# EAGLE design Domino LED Overlap No Teardrop (EAGLE 6.5.0)
DATABASE: ./../Common/BOM/Domino_DB.txt; DRAWN: M.STEMPIN; REV: A
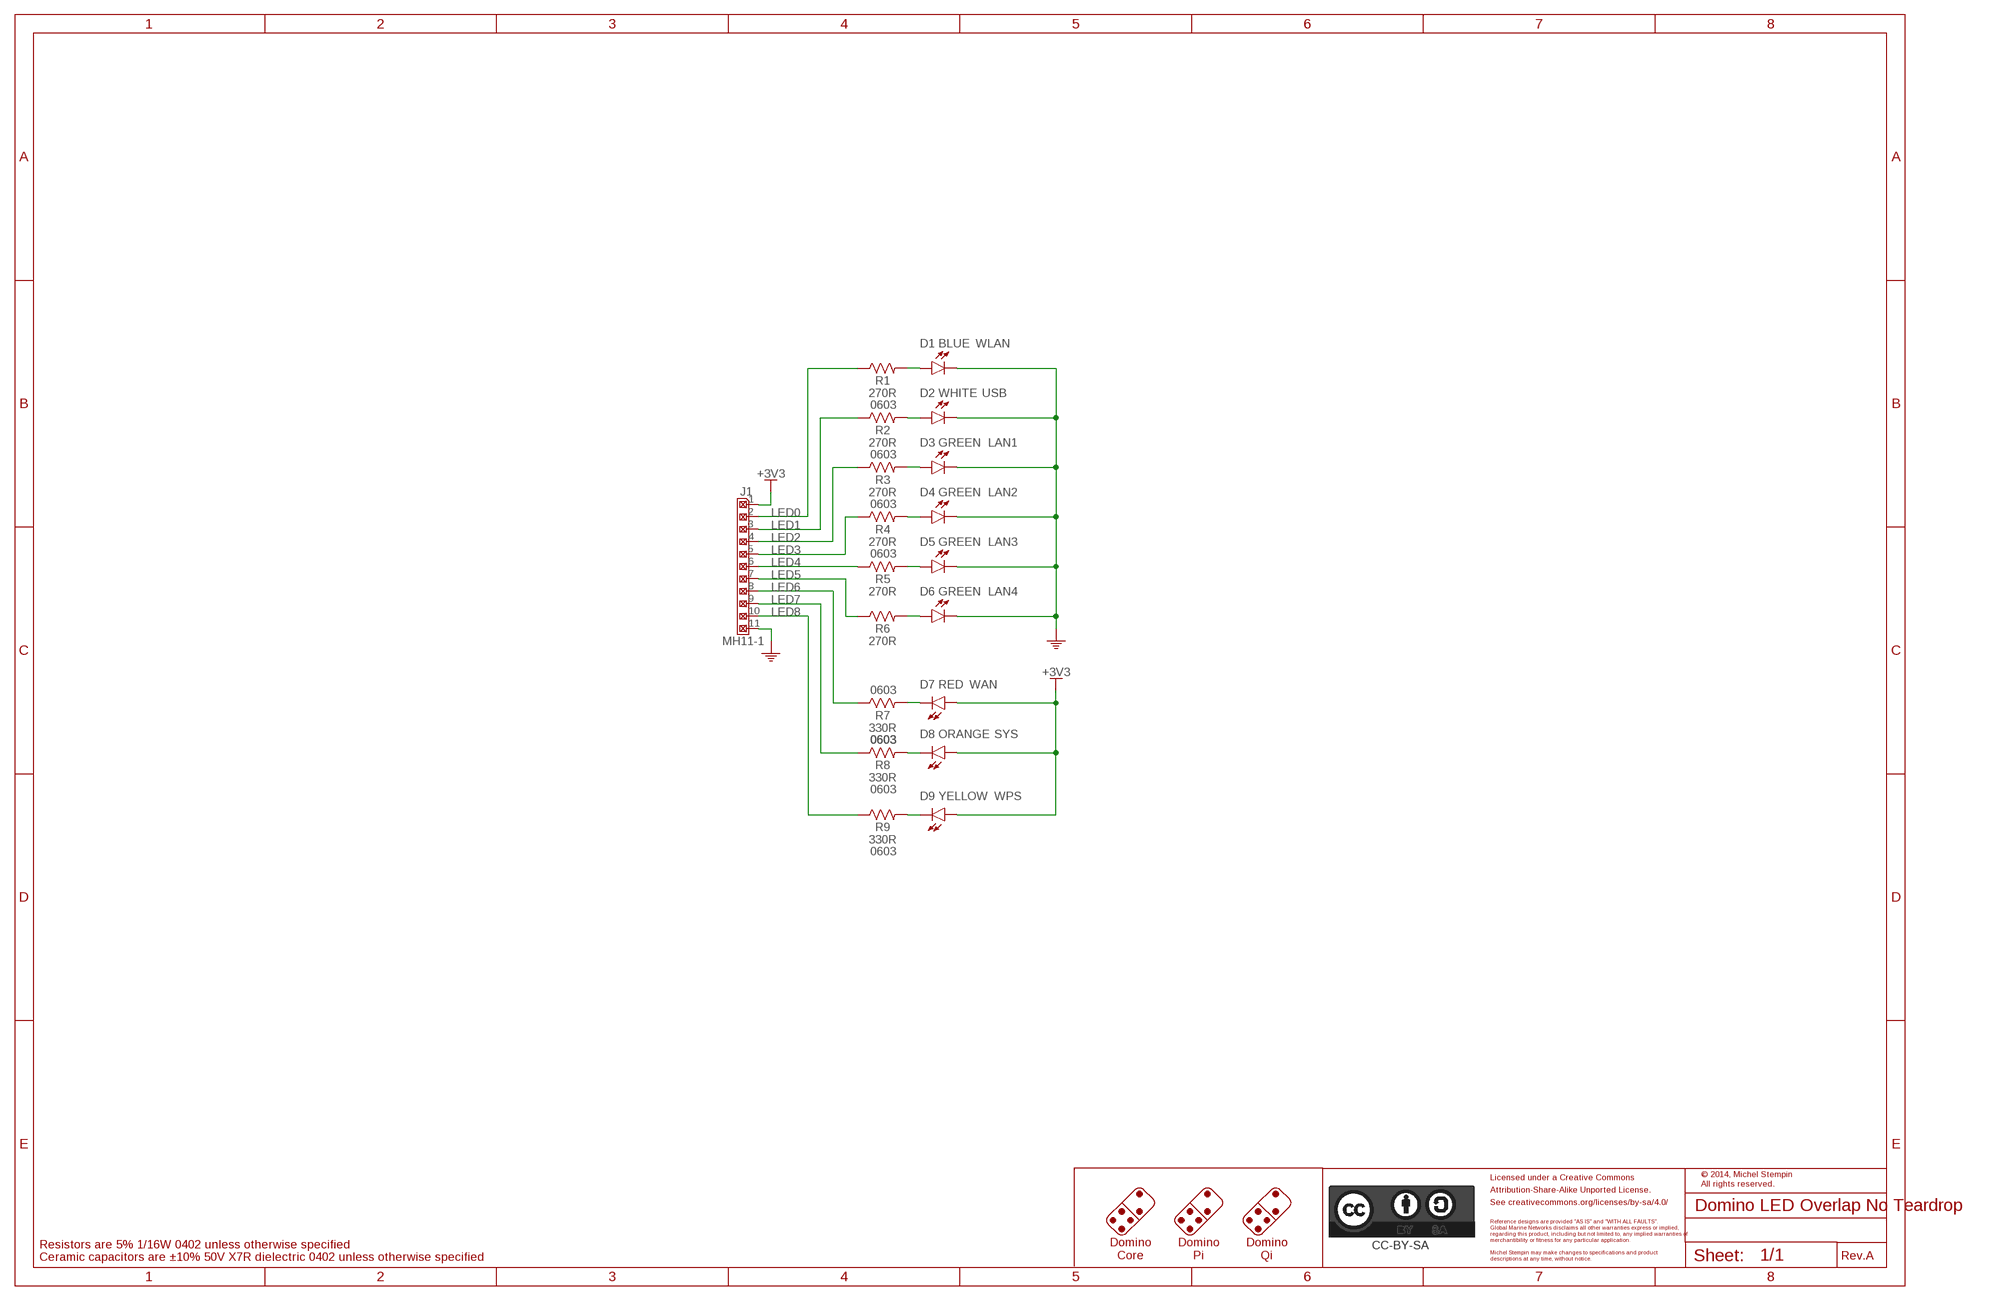
[diagram p0: schematic, sheet 1]

## Parts
CC-BY-SA1  CC-BY-SA_LOGO  [CC-BY-SA_LOGO]
D1  BLUE  LED_0603  [LED0603]
D2  WHITE  LED_0603  [LED0603]
D3  GREEN  LED_0603  [LED0603]
D4  GREEN  LED_0603  [LED0603]
D5  GREEN  LED_0603  [LED0603]
D6  GREEN  LED_0603  [LED0603]
D7  RED  LED_0603  [LED0603]
D8  ORANGE  LED_0603  [LED0603]
D9  YELLOW  LED_0603  [LED0603]
J1  MH11-1  [MH11-1-0.1]
R1  270R  RES_0603  [R0603]
R2  270R  RES_0603  [R0603]
R3  270R  RES_0603  [R0603]
R4  270R  RES_0603  [R0603]
R5  270R  RES_0603  [R0603]
R6  270R  RES_0603  [R0603]
R7  330R  RES_0603  [R0603]
R8  330R  RES_0603  [R0603]
R9  330R  RES_0603  [R0603]

## Nets
+3V3: D7.2(A) D8.2(A) D9.2(A) J1.1
GND: D1.1(C) D2.1(C) D3.1(C) D4.1(C) D5.1(C) D6.1(C) J1.11
LED0: J1.2 R1.1
LED1: J1.3 R2.1
LED2: J1.4 R3.1
LED3: J1.5 R4.1
LED4: J1.6 R5.1
LED5: J1.7 R6.1
LED6: J1.8 R7.1
LED7: J1.9 R8.1
LED8: J1.10 R9.1
N$2: D1.2(A) R1.2
N$3: D2.2(A) R2.2
N$4: D3.2(A) R3.2
N$5: D4.2(A) R4.2
N$6: D5.2(A) R5.2
N$7: D7.1(C) R7.2
N$8: D8.1(C) R8.2
N$9: D9.1(C) R9.2
N$10: D6.2(A) R6.2

## Notes on the sheet
- WLAN
- USB
- LAN1
- LAN2
- LAN3
- LAN4
- WAN
- SYS
- WPS
- Licensed under a Creative Commons
- © 2014, Michel Stempin
  All rights reserved.
- Attribution-Share-Alike Unported License.
- See creativecommons.org/licenses/by-sa/4.0/
- Reference designs are provided "AS IS" and "WITH ALL FAULTS".
- Global Marine Networks disclaims all other warranties express or implied,
- regarding this product, including but not limited to, any implied warranties of
- merchantibility or fitness for any particular application.
- Resistors are 5% 1/16W 0402 unless otherwise specified
- Domino
  Core
- Domino
  Pi
- Domino
  Qi
- Michel Stempin may make changes to specifications and product
- Ceramic capacitors are ±10% 50V X7R dielectric 0402 unless otherwise specified | descriptions at any time, without notice. | Rev.

## Library data of the parts
CC-BY-SA1 = Domino:CC-BY-SA_LOGO: Attribution-Share-Alike Unported License See creativecommons.org/licenses/by-sa/3.0/ for details.; BOM: EXCLUDE
D1 = Domino:LED_: LED; PARTNO: LED0603-BLUE
D2 = Domino:LED_: LED; PARTNO: LED0603-WHITE
D3-D6 = Domino:LED_: LED; PARTNO: LED0603-GREEN
D7 = Domino:LED_: LED; PARTNO: LED0603-RED
D8 = Domino:LED_: LED; PARTNO: LED0603-ORANGE
D9 = Domino:LED_: LED; PARTNO: LED0603-YELLOW
J1 = Domino:MH11-1: 11x1 Pin Male Header; PARTNO: MH11-1-0.1
R1-R6 = Domino:RES_: Resistor; PARTNO: R0603_270R_5%_125mW; RATE: 125mW; SIZE: 0603; TOL: 5%
R7-R9 = Domino:RES_: Resistor; PARTNO: R0603_330R_5%_125mW; RATE: 125mW; SIZE: 0603; TOL: 5%

## Net classes
1 USB: width 0.254 mm, clearance 0.127 mm
2 PoE: width 0.61 mm, clearance 0.13 mm to class 0, clearance 0.13 mm to class 1, clearance 0.13 mm

## Board
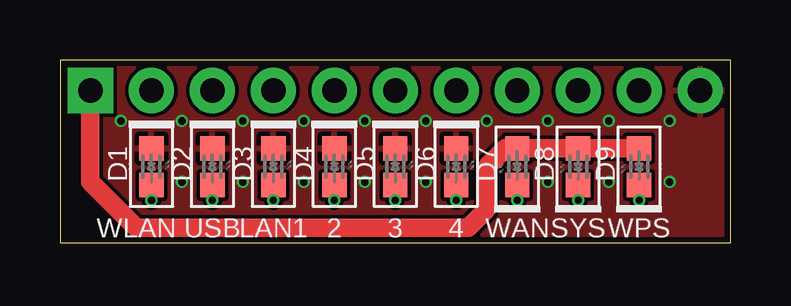
[diagram p1: board, top side]
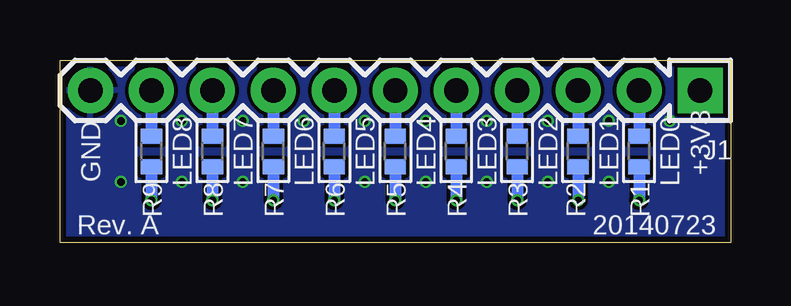
[diagram p2: board, bottom side, seen from below]

Size 27.94 x 7.62 mm. Coordinates in mm from the lower left corner, seen from the top.
Outline: 0,0 27.94,0 27.94,7.62 0,7.62 0,0
Copper layers (1*16): Top 0.043mm / dielectric 1mm / Bottom 0.043mm
Design rules "Domino": minimum track width 0.1mm, minimum drill 0.3mm, track to track 6mil, track to pad 6mil, pad to pad 6mil, via to via 6mil, smd to smd 0mil, copper to edge 0.25mm, drill to drill 0.35mm, minimum pad ring 0.085mm, minimum via ring 0.1mm, stop-mask expansion 0mil, vias tented up to drill 0.45mm, thermal gap 0.2mm

### Footprints (pad centres in the part's own frame; a part is rotated, then mirrored left to right if it is on the bottom)
LED0603 = smd 1.016 x 1.016: 1 -0.762,0; 2 0.762,0
MH11-1-0.1 = drill 1.016 pad 1.88 square: 1 0,0 | drill 1.016 pad 1.88: 2 2.54,0; 3 5.08,0; 4 7.62,0; 5 10.16,0; 6 12.7,0; 7 15.24,0; 8 17.78,0; 9 20.32,0; 10 22.86,0; 11 25.4,0
R0603 = smd 0.635 x 0.889: 1 -0.635,0; 2 0.635,0

### Placement (x,y rotation side)
CC-BY-SA1  -5.08,-50.8 0 top  (outside the outline)
D1  3.81,3.17 270 top
D2  6.35,3.17 270 top
D3  8.89,3.17 270 top
D4  11.43,3.17 270 top
D5  13.97,3.17 270 top
D6  16.51,3.17 270 top
D7  19.05,3.17 90 top
D8  21.59,3.17 90 top
D9  24.13,3.17 90 top
DRILEGEND  [DRILEGEND]  80.26,59.94 0 top  (outside the outline)
J1  1.27,6.35 180 bottom
R1  3.81,3.81 270 bottom
R2  6.35,3.81 270 bottom
R3  8.89,3.81 270 bottom
R4  11.43,3.81 270 bottom
R5  13.97,3.81 270 bottom
R6  16.51,3.81 270 bottom
R7  19.05,3.81 270 bottom
R8  21.59,3.81 270 bottom
R9  24.13,3.81 270 bottom
U$3  [A5L-LOC]  -55.88,-62.23 0 top  (outside the outline)
U$4  [DOMINO_LOGO_SMALL]  22.86,17.65 0 bottom  (outside the outline)

### Tracks (layer width: path | path; a pad name or v marks a point on that pad's centre or on a via)
+3V3
  Top 0.762: D9.2 D8.2 D7.2 18.54,3.94 17.78,3.17 17.78,1.4 17.02,0.64 3.17,0.64 1.27,2.54 J1.1
GND  (via drill 0.3 pad 0.03)
  other vias: 2.54,5.08 5.08,5.08 7.62,5.08 10.16,5.08 12.7,5.08 15.24,5.08 17.78,5.08 20.32,5.08 22.86,5.08 25.4,5.08 25.4,2.54 22.86,2.54 20.32,2.54 15.24,2.54 12.7,2.54 10.16,2.54 7.62,2.54 5.08,2.54
  pour Top: 0,7.62 27.94,7.62 27.94,0 0,0
  pour Bottom: 0,7.62 27.94,7.62 27.94,0 0,0
LED0
  Bottom 0.508: J1.2 R1.1
LED1
  Bottom 0.508: J1.3 R2.1
LED2
  Bottom 0.508: J1.4 R3.1
LED3
  Bottom 0.508: J1.5 R4.1
LED4
  Bottom 0.508: J1.6 R5.1
LED5
  Bottom 0.508: J1.7 R6.1
LED6
  Bottom 0.508: J1.8 R7.1
LED7
  Bottom 0.508: J1.9 R8.1
LED8
  Bottom 0.508: J1.10 R9.1
N$2  (via drill 0.3 pad 0.03)
  Top 0.508: v3.81,1.78 D1.2
  Bottom 0.508: R1.2 v3.81,1.78
N$3  (via drill 0.3 pad 0.03)
  Top 0.508: v6.35,1.78 D2.2
  Bottom 0.508: R2.2 v6.35,1.78
N$4  (via drill 0.3 pad 0.03)
  Top 0.508: v8.89,1.78 D3.2
  Bottom 0.508: R3.2 v8.89,1.78
N$5  (via drill 0.3 pad 0.03)
  Top 0.508: v11.43,1.78 D4.2
  Bottom 0.508: R4.2 v11.43,1.78
N$6  (via drill 0.3 pad 0.03)
  Top 0.508: v13.97,1.78 D5.2
  Bottom 0.508: R5.2 v13.97,1.78
N$7  (via drill 0.3 pad 0.03)
  Top 0.508: v19.05,1.78 D7.1
  Bottom 0.508: R7.2 v19.05,1.78
N$8  (via drill 0.3 pad 0.03)
  Top 0.508: v21.59,1.78 D8.1
  Bottom 0.508: R8.2 v21.59,1.78
N$9  (via drill 0.3 pad 0.03)
  Top 0.508: v24.13,1.78 D9.1
  Bottom 0.508: R9.2 v24.13,1.78
N$10  (via drill 0.3 pad 0.03)
  Top 0.508: v16.51,1.78 D6.2
  Bottom 0.508: R6.2 v16.51,1.78

### Text on the board
tPlace: WLAN | USB | LAN1 | 2 | 3 | 4 | WAN | SYS | WPS
bPlace: +3V3 | LED0 | LED1 | LED2 | LED3 | LED4 | LED5 | LED6 | LED7 | LED8 | GND
bNames: Rev. A
Document: DRILL CHART: TOP TO BOTTOM | STACK-UP FOR REFERENCE | LAYER 1 L1 TOP | 18 UM CU + 12.5 UM PLATING (30.5 UM) | 1.061 MM+/-10% | CORE | 1.0 MM CORE FR-4 LG 135 / INCLUDING COPPER | LAYER 4 L16 BOTTOM | 18 UM CU + 12.5 UM PLATING (30.5 UM) | NOTES: | 1. PRINTED CIRCUIT BOARD MADE FROM NEMA GRADE FR-4 TG 135 EPOXY / LAMINATE WITH 18 UM COPPER PLATING AND 1 MM THICKNESS. | 2. ALL DIMENSIONS ARE GIVEN IN MILLIMETERS EXCEPT TRACE WIDTH/SPACE. | 3. CIRCUIT PATHS ARE FOR REFERENCE ONLY. | 4. HOLE SIZES SHOWN ARE FINISHED DIAMETERS AFTER PLATING. | 5. BOARD PLATED USING REFLOW OR SIMILAR METHOD. | 6. BOARD TO HAVE WHITE SOLDER MASK ON PLATED SURFACES USING WET / FILM SR100 OR SR1010 EPOXY. / EQUIVALENT WET OR DRY FILM MAY BE USED. | 7. SILKSCREEN BOARD USING BLACK INK. DISTORTION OF SILKSCREEN / IS ACCEPTABLE OVER TRACES. EPOXY INK ON PLATED LANDS IS NOT / ACCEPTABLE | 8. THE FOLLOWING INFORMATION APPLIES TO THIS BOARD: | * 2 COPPER LAYERS | * 1 MM BOARD THICKNESS | * REQUIRES TOP AND BOTTOM SIDE SILKSCREENS | © 2014, The Domino Team. / All rights reserved. | Licensed under a Creative Commons / Attribution-Share-Alike Unported License. / See creativecommons.org/licenses/by-sa/4.0/ | Reference designs are provided "AS IS" and "WITH ALL FAULTS". / The Domino Team disclaims all other warranties express or implied, / regarding this product, including but not limited to, any implied warranties of / merchantibility or fitness for any particular application. | Domino / Core | Domino / Pi | Domino / Qi | The Domino Team may make changes to specifications and product descriptions / at any time, without notice. | Rev.
DrillLegend: LAYER-STACK
DrillLegend_01-16: 01-16
Pinout: +3V3 | LED0 | LED1 | ELD2 | LED3 | LED4 | LED5 | LED6 | LED7 | LED8 | GND | Pinout (.PIN)
Component_side: Component Side (.CMP)
Solder_side: Solder side (.SOL)
Silk_screen_CMP: Silk screen CMP (.PLC)
Silk_screen_SOL: Silk screen SOL (.PLS)
Solder_stop_mask_CMP: Solder stop mask CMP (.STC)
Solder_stop_mask_SOL: Solder stop mask SOL (.STS)
Cream_frame_CMP: Cream frame CMP (.CRC)
Cream_frame_SOL: Cream frame SOL (.CRS)
Drill_data: Drill data (.DRD)
Component_Assembly_CMP: Component Assembly CMP (.ASC)
Component_Assembly_SOL: Component Assembly SOL (.ASS)
Outline: Outline (.OLN)